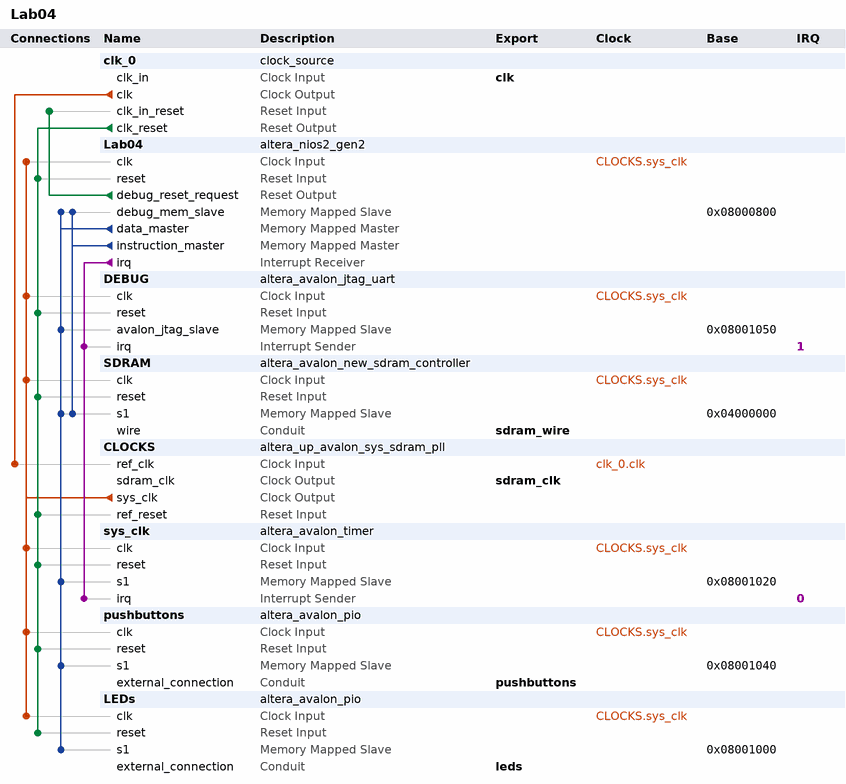
[diagram p0: system contents]
# Platform Designer (Qsys) system Lab04, Cyclone V 5CSXFC6D6F31C6
# Parameters at their usual value, and those the tool derives, are not listed.
package require -exact qsys 22.1
create_system Lab04
set_project_property DEVICE_FAMILY {Cyclone V}
set_project_property DEVICE 5CSXFC6D6F31C6

add_instance clk_0 clock_source 22.1
set_instance_parameter_value clk_0 clockFrequency 50000000

add_instance Lab04 altera_nios2_gen2 22.1
set_instance_parameter_value Lab04 dcache_size 2048
set_instance_parameter_value Lab04 exceptionSlave SDRAM.s1
set_instance_parameter_value Lab04 icache_size 4096
set_instance_parameter_value Lab04 impl Tiny
set_instance_parameter_value Lab04 resetSlave SDRAM.s1

add_instance DEBUG altera_avalon_jtag_uart 22.1
set_instance_parameter_value DEBUG simInteractiveOptions NO_INTERACTIVE_WINDOWS

add_instance SDRAM altera_avalon_new_sdram_controller 20.1
set_instance_parameter_value SDRAM TAC 5.4
set_instance_parameter_value SDRAM TRCD 15.0
set_instance_parameter_value SDRAM TRP 15.0
set_instance_parameter_value SDRAM casLatency 3
set_instance_parameter_value SDRAM columnWidth 10
set_instance_parameter_value SDRAM dataWidth 16
set_instance_parameter_value SDRAM generateSimulationModel false
set_instance_parameter_value SDRAM model single_Micron_MT48LC4M32B2_7_chip
set_instance_parameter_value SDRAM numberOfBanks 4
set_instance_parameter_value SDRAM numberOfChipSelects 1
set_instance_parameter_value SDRAM powerUpDelay 100.0
set_instance_parameter_value SDRAM refreshPeriod 7.8125
set_instance_parameter_value SDRAM rowWidth 13

add_instance CLOCKS altera_up_avalon_sys_sdram_pll 18.0
set_instance_parameter_value CLOCKS CV_boards DE10-Standard
set_instance_parameter_value CLOCKS gui_outclk 50.0
set_instance_parameter_value CLOCKS gui_refclk 50.0

add_instance sys_clk altera_avalon_timer 22.1
set_instance_parameter_value sys_clk period 1
set_instance_parameter_value sys_clk periodUnits MSEC

add_instance pushbuttons altera_avalon_pio 22.1
set_instance_parameter_value pushbuttons direction Input
set_instance_parameter_value pushbuttons width 4

add_instance LEDs altera_avalon_pio 22.1
set_instance_parameter_value LEDs bitModifyingOutReg true
set_instance_parameter_value LEDs direction Output
set_instance_parameter_value LEDs width 10

# connections
add_connection clk_0.clk CLOCKS.ref_clk clock
add_connection CLOCKS.sys_clk DEBUG.clk clock
add_connection CLOCKS.sys_clk Lab04.clk clock
add_connection CLOCKS.sys_clk LEDs.clk clock
add_connection CLOCKS.sys_clk pushbuttons.clk clock
add_connection CLOCKS.sys_clk SDRAM.clk clock
add_connection CLOCKS.sys_clk sys_clk.clk clock
add_connection clk_0.clk_reset CLOCKS.ref_reset reset
add_connection clk_0.clk_reset DEBUG.reset reset
add_connection clk_0.clk_reset Lab04.reset reset
add_connection clk_0.clk_reset LEDs.reset reset
add_connection clk_0.clk_reset pushbuttons.reset reset
add_connection clk_0.clk_reset SDRAM.reset reset
add_connection clk_0.clk_reset sys_clk.reset reset
add_connection Lab04.debug_reset_request clk_0.clk_in_reset reset
add_connection Lab04.data_master DEBUG.avalon_jtag_slave avalon
set_connection_parameter_value Lab04.data_master/DEBUG.avalon_jtag_slave baseAddress 0x08001050
add_connection Lab04.data_master Lab04.debug_mem_slave avalon
set_connection_parameter_value Lab04.data_master/Lab04.debug_mem_slave baseAddress 0x08000800
add_connection Lab04.data_master LEDs.s1 avalon
set_connection_parameter_value Lab04.data_master/LEDs.s1 baseAddress 0x08001000
add_connection Lab04.data_master pushbuttons.s1 avalon
set_connection_parameter_value Lab04.data_master/pushbuttons.s1 baseAddress 0x08001040
add_connection Lab04.data_master SDRAM.s1 avalon
set_connection_parameter_value Lab04.data_master/SDRAM.s1 baseAddress 0x04000000
add_connection Lab04.data_master sys_clk.s1 avalon
set_connection_parameter_value Lab04.data_master/sys_clk.s1 baseAddress 0x08001020
add_connection Lab04.instruction_master Lab04.debug_mem_slave avalon
set_connection_parameter_value Lab04.instruction_master/Lab04.debug_mem_slave baseAddress 0x08000800
add_connection Lab04.instruction_master SDRAM.s1 avalon
set_connection_parameter_value Lab04.instruction_master/SDRAM.s1 baseAddress 0x04000000
add_connection Lab04.irq DEBUG.irq interrupt
set_connection_parameter_value Lab04.irq/DEBUG.irq irqNumber 1
add_connection Lab04.irq sys_clk.irq interrupt
set_connection_parameter_value Lab04.irq/sys_clk.irq irqNumber 0

# exported interfaces
add_interface clk clock sink
set_interface_property clk EXPORT_OF clk_0.clk_in
add_interface leds conduit end
set_interface_property leds EXPORT_OF LEDs.external_connection
add_interface pushbuttons conduit end
set_interface_property pushbuttons EXPORT_OF pushbuttons.external_connection
add_interface sdram_clk clock source
set_interface_property sdram_clk EXPORT_OF CLOCKS.sdram_clk
add_interface sdram_wire conduit end
set_interface_property sdram_wire EXPORT_OF SDRAM.wire

set_interconnect_requirement {$system} qsys_mm.clockCrossingAdapter HANDSHAKE
set_interconnect_requirement {$system} qsys_mm.enableEccProtection FALSE
set_interconnect_requirement {$system} qsys_mm.insertDefaultSlave FALSE
set_interconnect_requirement {$system} qsys_mm.maxAdditionalLatency 1

save_system Lab04.qsys
